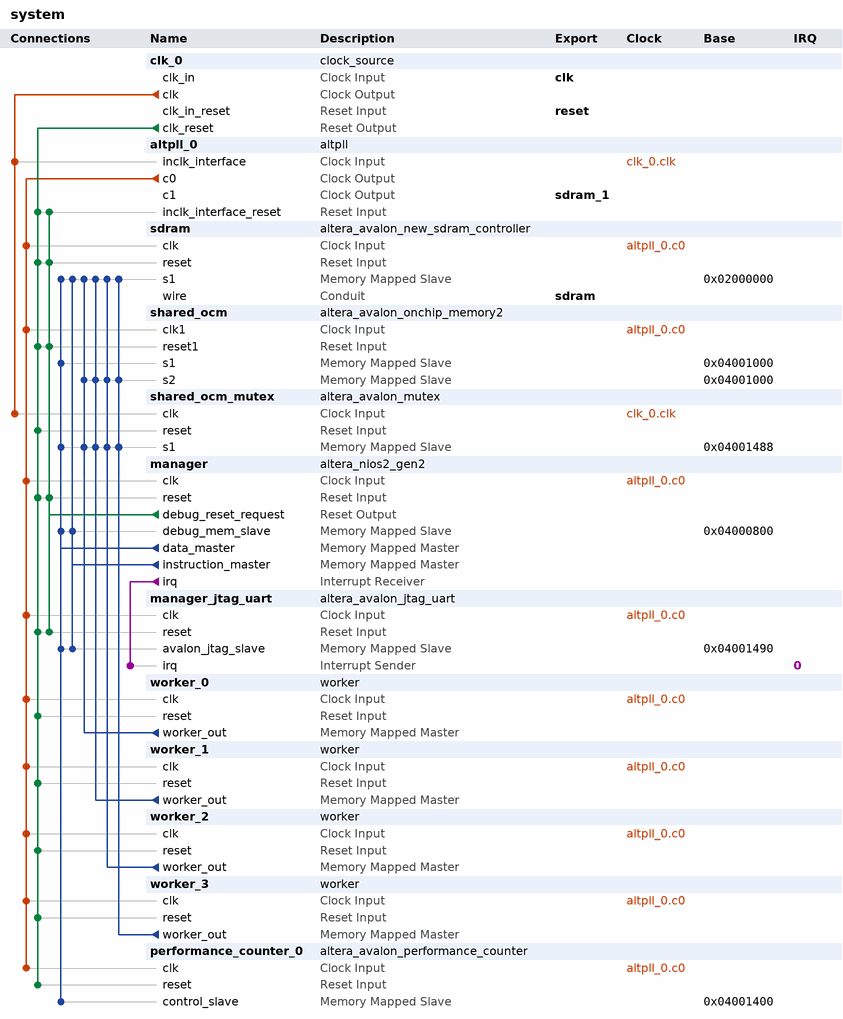
[diagram p0: system contents]
# Platform Designer (Qsys) system system, Cyclone IV E EP4CE22F17C6
# Parameters at their usual value, and those the tool derives, are not listed.
package require -exact qsys 18.1
create_system system
set_project_property DEVICE_FAMILY {Cyclone IV E}
set_project_property DEVICE EP4CE22F17C6

add_instance clk_0 clock_source 18.1
set_instance_parameter_value clk_0 clockFrequency 50000000

add_instance altpll_0 altpll 18.1
set_instance_parameter_value altpll_0 CLK0_DIVIDE_BY 1
set_instance_parameter_value altpll_0 CLK0_MULTIPLY_BY 2
set_instance_parameter_value altpll_0 CLK1_DIVIDE_BY 1
set_instance_parameter_value altpll_0 CLK1_DUTY_CYCLE 50
set_instance_parameter_value altpll_0 CLK1_MULTIPLY_BY 2
set_instance_parameter_value altpll_0 CLK1_PHASE_SHIFT -3000
set_instance_parameter_value altpll_0 INCLK0_INPUT_FREQUENCY 20000
set_instance_parameter_value altpll_0 PORT_ARESET PORT_UNUSED
set_instance_parameter_value altpll_0 PORT_LOCKED PORT_UNUSED
set_instance_parameter_value altpll_0 PORT_clk1 PORT_USED
set_instance_parameter_value altpll_0 PORT_clk2 PORT_UNUSED
set_instance_parameter_value altpll_0 PORT_clk3 PORT_UNUSED

add_instance sdram altera_avalon_new_sdram_controller 18.1
set_instance_parameter_value sdram TAC 5.5
set_instance_parameter_value sdram TRCD 20.0
set_instance_parameter_value sdram TRP 20.0
set_instance_parameter_value sdram casLatency 3
set_instance_parameter_value sdram columnWidth 9
set_instance_parameter_value sdram dataWidth 16
set_instance_parameter_value sdram generateSimulationModel false
set_instance_parameter_value sdram model single_Micron_MT48LC4M32B2_7_chip
set_instance_parameter_value sdram numberOfBanks 4
set_instance_parameter_value sdram numberOfChipSelects 1
set_instance_parameter_value sdram powerUpDelay 100.0
set_instance_parameter_value sdram refreshPeriod 7.8125
set_instance_parameter_value sdram rowWidth 13

add_instance shared_ocm altera_avalon_onchip_memory2 18.1
set_instance_parameter_value shared_ocm dataWidth 32
set_instance_parameter_value shared_ocm dualPort true
set_instance_parameter_value shared_ocm initMemContent true
set_instance_parameter_value shared_ocm initializationFileName onchip_mem.hex
set_instance_parameter_value shared_ocm memorySize 512
set_instance_parameter_value shared_ocm singleClockOperation true

add_instance shared_ocm_mutex altera_avalon_mutex 18.1
set_instance_parameter_value shared_ocm_mutex initialOwner 1
set_instance_parameter_value shared_ocm_mutex initialValue 1

add_instance manager altera_nios2_gen2 18.1
set_instance_parameter_value manager cpuID 1
set_instance_parameter_value manager dcache_size 1024
set_instance_parameter_value manager exceptionSlave sdram.s1
set_instance_parameter_value manager icache_size 2048
set_instance_parameter_value manager impl Fast
set_instance_parameter_value manager mul_32_impl 3
set_instance_parameter_value manager resetSlave sdram.s1

add_instance manager_jtag_uart altera_avalon_jtag_uart 18.1
set_instance_parameter_value manager_jtag_uart simInteractiveOptions NO_INTERACTIVE_WINDOWS

add_instance worker_0 worker 1.0
set_instance_parameter_value worker_0 cpu_id 2
set_instance_parameter_value worker_0 reset_offset_in_sdram 34603008

add_instance worker_1 worker 1.0
set_instance_parameter_value worker_1 cpu_id 4
set_instance_parameter_value worker_1 reset_offset_in_sdram 35651584

add_instance worker_2 worker 1.0
set_instance_parameter_value worker_2 cpu_id 8
set_instance_parameter_value worker_2 reset_offset_in_sdram 36700160

add_instance worker_3 worker 1.0
set_instance_parameter_value worker_3 cpu_id 16
set_instance_parameter_value worker_3 reset_offset_in_sdram 37748736

add_instance performance_counter_0 altera_avalon_performance_counter 18.1
set_instance_parameter_value performance_counter_0 numberOfSections 5

# connections
add_connection altpll_0.c0 manager.clk clock
add_connection altpll_0.c0 manager_jtag_uart.clk clock
add_connection altpll_0.c0 performance_counter_0.clk clock
add_connection altpll_0.c0 sdram.clk clock
add_connection altpll_0.c0 shared_ocm.clk1 clock
add_connection altpll_0.c0 worker_0.clk clock
add_connection altpll_0.c0 worker_1.clk clock
add_connection altpll_0.c0 worker_2.clk clock
add_connection altpll_0.c0 worker_3.clk clock
add_connection clk_0.clk altpll_0.inclk_interface clock
add_connection clk_0.clk shared_ocm_mutex.clk clock
add_connection clk_0.clk_reset altpll_0.inclk_interface_reset reset
add_connection clk_0.clk_reset manager.reset reset
add_connection clk_0.clk_reset manager_jtag_uart.reset reset
add_connection clk_0.clk_reset performance_counter_0.reset reset
add_connection clk_0.clk_reset sdram.reset reset
add_connection clk_0.clk_reset shared_ocm.reset1 reset
add_connection clk_0.clk_reset shared_ocm_mutex.reset reset
add_connection clk_0.clk_reset worker_0.reset reset
add_connection clk_0.clk_reset worker_1.reset reset
add_connection clk_0.clk_reset worker_2.reset reset
add_connection clk_0.clk_reset worker_3.reset reset
add_connection manager.debug_reset_request altpll_0.inclk_interface_reset reset
add_connection manager.debug_reset_request manager.reset reset
add_connection manager.debug_reset_request manager_jtag_uart.reset reset
add_connection manager.debug_reset_request sdram.reset reset
add_connection manager.debug_reset_request shared_ocm.reset1 reset
add_connection manager.data_master manager.debug_mem_slave avalon
set_connection_parameter_value manager.data_master/manager.debug_mem_slave baseAddress 0x04000800
add_connection manager.data_master manager_jtag_uart.avalon_jtag_slave avalon
set_connection_parameter_value manager.data_master/manager_jtag_uart.avalon_jtag_slave baseAddress 0x04001490
add_connection manager.data_master performance_counter_0.control_slave avalon
set_connection_parameter_value manager.data_master/performance_counter_0.control_slave baseAddress 0x04001400
add_connection manager.data_master sdram.s1 avalon
set_connection_parameter_value manager.data_master/sdram.s1 baseAddress 0x02000000
add_connection manager.data_master shared_ocm.s1 avalon
set_connection_parameter_value manager.data_master/shared_ocm.s1 baseAddress 0x04001000
add_connection manager.data_master shared_ocm_mutex.s1 avalon
set_connection_parameter_value manager.data_master/shared_ocm_mutex.s1 baseAddress 0x04001488
add_connection manager.instruction_master manager.debug_mem_slave avalon
set_connection_parameter_value manager.instruction_master/manager.debug_mem_slave baseAddress 0x04000800
add_connection manager.instruction_master manager_jtag_uart.avalon_jtag_slave avalon
set_connection_parameter_value manager.instruction_master/manager_jtag_uart.avalon_jtag_slave baseAddress 0x04001490
add_connection manager.instruction_master sdram.s1 avalon
set_connection_parameter_value manager.instruction_master/sdram.s1 baseAddress 0x02000000
add_connection worker_0.worker_out sdram.s1 avalon
set_connection_parameter_value worker_0.worker_out/sdram.s1 baseAddress 0x02000000
add_connection worker_0.worker_out shared_ocm.s2 avalon
set_connection_parameter_value worker_0.worker_out/shared_ocm.s2 baseAddress 0x04001000
add_connection worker_0.worker_out shared_ocm_mutex.s1 avalon
set_connection_parameter_value worker_0.worker_out/shared_ocm_mutex.s1 baseAddress 0x04001488
add_connection worker_1.worker_out sdram.s1 avalon
set_connection_parameter_value worker_1.worker_out/sdram.s1 baseAddress 0x02000000
add_connection worker_1.worker_out shared_ocm.s2 avalon
set_connection_parameter_value worker_1.worker_out/shared_ocm.s2 baseAddress 0x04001000
add_connection worker_1.worker_out shared_ocm_mutex.s1 avalon
set_connection_parameter_value worker_1.worker_out/shared_ocm_mutex.s1 baseAddress 0x04001488
add_connection worker_2.worker_out sdram.s1 avalon
set_connection_parameter_value worker_2.worker_out/sdram.s1 baseAddress 0x02000000
add_connection worker_2.worker_out shared_ocm.s2 avalon
set_connection_parameter_value worker_2.worker_out/shared_ocm.s2 baseAddress 0x04001000
add_connection worker_2.worker_out shared_ocm_mutex.s1 avalon
set_connection_parameter_value worker_2.worker_out/shared_ocm_mutex.s1 baseAddress 0x04001488
add_connection worker_3.worker_out sdram.s1 avalon
set_connection_parameter_value worker_3.worker_out/sdram.s1 baseAddress 0x02000000
add_connection worker_3.worker_out shared_ocm.s2 avalon
set_connection_parameter_value worker_3.worker_out/shared_ocm.s2 baseAddress 0x04001000
add_connection worker_3.worker_out shared_ocm_mutex.s1 avalon
set_connection_parameter_value worker_3.worker_out/shared_ocm_mutex.s1 baseAddress 0x04001488
add_connection manager.irq manager_jtag_uart.irq interrupt
set_connection_parameter_value manager.irq/manager_jtag_uart.irq irqNumber 0

# exported interfaces
add_interface clk clock sink
set_interface_property clk EXPORT_OF clk_0.clk_in
add_interface reset reset sink
set_interface_property reset EXPORT_OF clk_0.clk_in_reset
add_interface sdram conduit end
set_interface_property sdram EXPORT_OF sdram.wire
add_interface sdram_1 clock source
set_interface_property sdram_1 EXPORT_OF altpll_0.c1

set_interconnect_requirement {$system} qsys_mm.clockCrossingAdapter HANDSHAKE
set_interconnect_requirement {$system} qsys_mm.enableEccProtection FALSE
set_interconnect_requirement {$system} qsys_mm.insertDefaultSlave FALSE
set_interconnect_requirement {$system} qsys_mm.maxAdditionalLatency 1

save_system system.qsys
